# EAGLE schematic PR9010 (EAGLE 7.2.0)
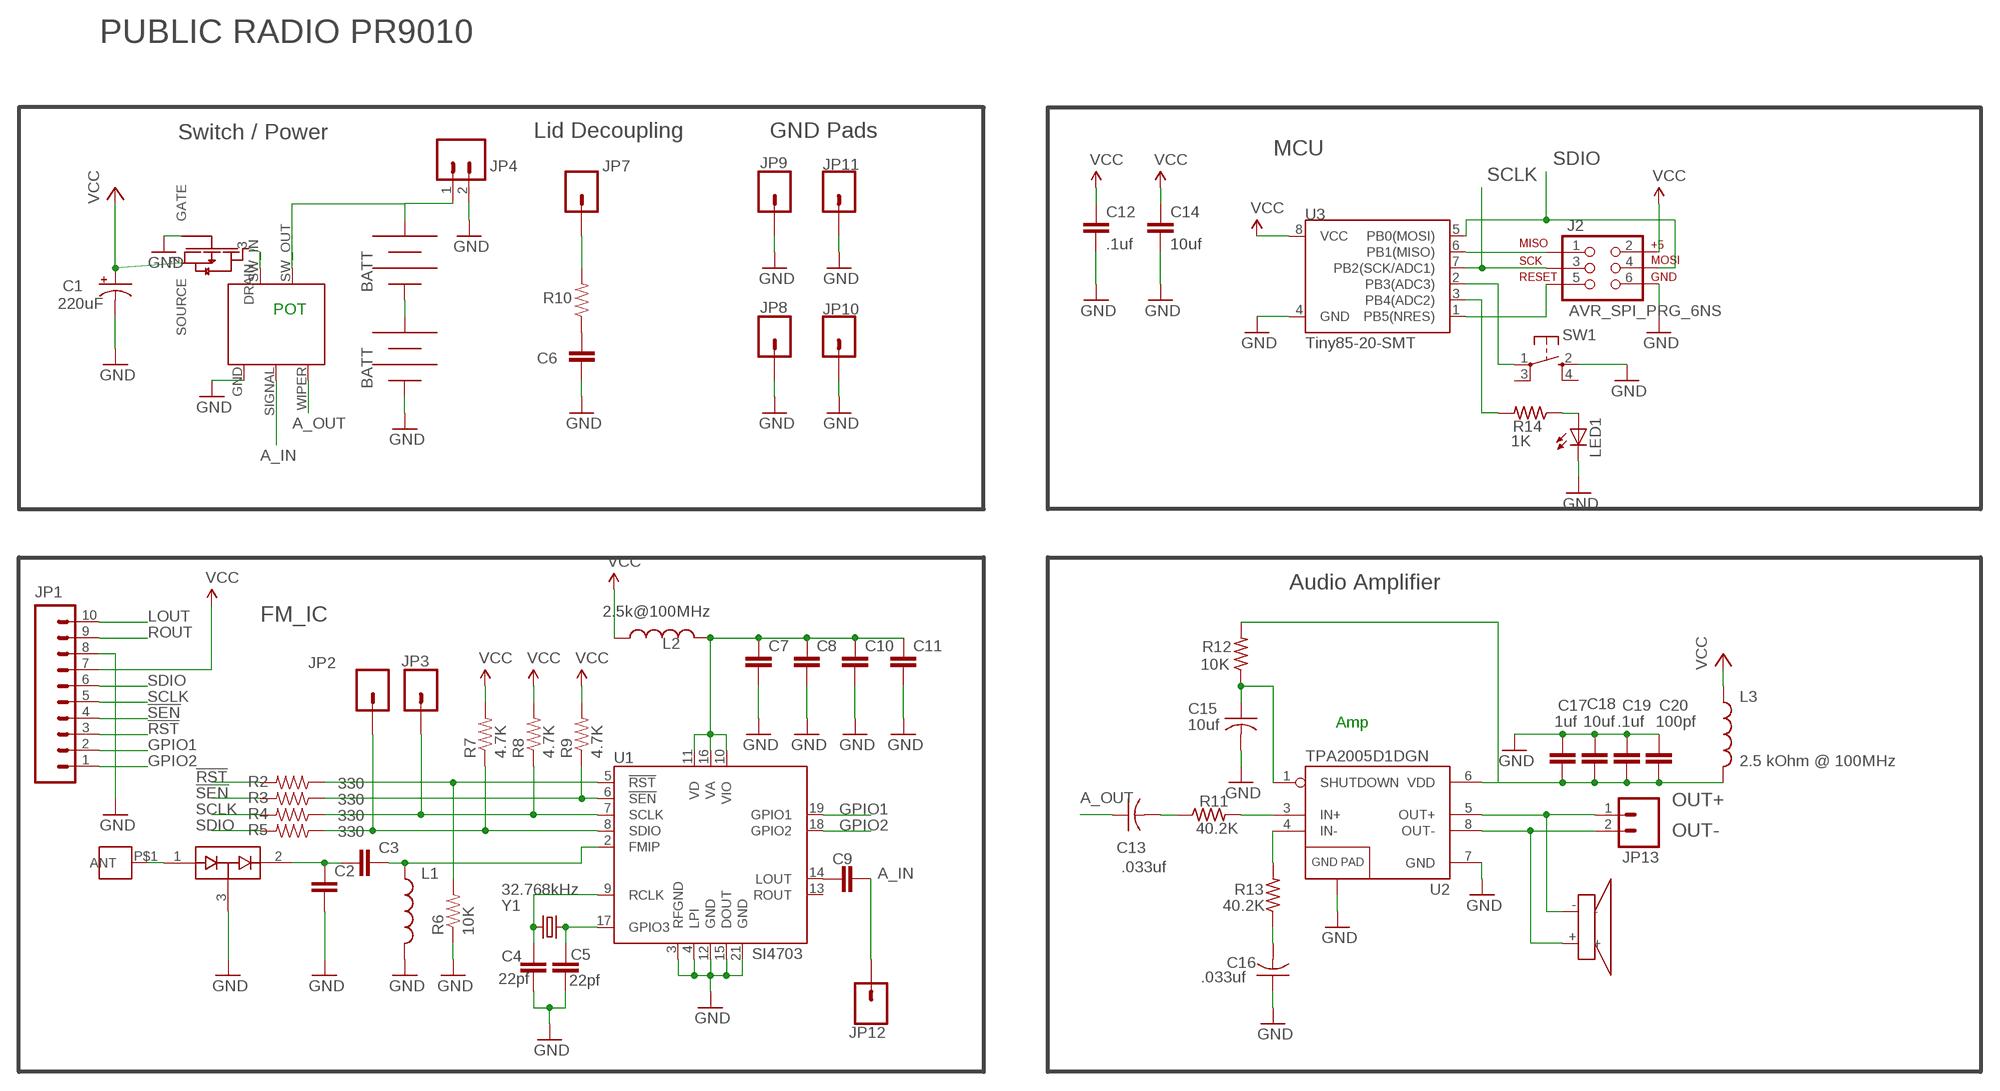
[diagram p0: schematic, sheet 1]

## Parts
C1  220uF  CAP_POLC  [PANASONIC_C]
C2  1.0uF  1.0UF-25V-+80/-20(0805)  [0805]
C3  1.0uF  1.0UF-25V-+80/-20(0805)  [0805]
C4  22pf  CAP0805  [0805]
C5  22pf  CAP0805  [0805]
C6  CAP0805  [0805]
C7  1.0uF  1.0UF-25V-+80/-20(0805)  [0805]
C8  1.0uF  1.0UF-25V-+80/-20(0805)  [0805]
C9  1.0uF  1.0UF-25V-+80/-20(0805)  [0805]
C10  1.0uF  1.0UF-25V-+80/-20(0805)  [0805]
C11  1.0uF  1.0UF-25V-+80/-20(0805)  [0805]
C12  .1uf  CAP0805  [0805]
C13  .033uf  C-USC0603  [C0603]
C14  10uf  CAP0805  [0805]
C15  10uf  C-USC0603  [C0603]
C16  .033uf  C-USC0603  [C0603]
C17  1uf  CAP0805  [0805]
C18  10uf  CAP0805  [0805]
C19  .1uf  CAP0805  [0805]
C20  100pf  CAP0805  [0805]
D1  BAV99  [SOT23]
FET1  SI2333DDS  [SI2333DDS]
J1  M3_SCREW_POST  [M3_SCREW_POST]
J2  AVR_SPI_PRG_6NS  [2X3-NS]
JP1  M10"  [1X10]
JP2  M01PTH  [1X01]
JP3  M01PTH  [1X01]
JP4  M02PTH3  [1X02_LONGPADS]
JP5  BK-92_MPD_AA_BATT_CLIP  [BK-92_MPD_AA_BATT_CLIP]
JP6  BK-92_MPD_AA_BATT_CLIP  [BK-92_MPD_AA_BATT_CLIP]
JP7  M01PTH  [1X01]
JP8  M01PTH  [1X01]
JP9  M01PTH  [1X01]
JP10  M01PTH  [1X01]
JP11  M01PTH  [1X01]
JP12  M01PTH  [1X01]
JP13  M02PTH3  [1X02_LONGPADS]
L1  INDUCTOR0805  [0805]
L2  2.5k@100MHz  INDUCTOR0603  [0603]
L3  2.5 kOhm @ 100MHz  INDUCTOR0603  [0603]
LED1  LEDSML0603  [SML0603]
R1  RV170SF_TAIWANA_POT_SW  [RV170SF_TAIWANA_POT_SW]
R2  330  RESISTOR0805-RES  [0805]
R3  330  RESISTOR0805-RES  [0805]
R4  330  RESISTOR0805-RES  [0805]
R5  330  RESISTOR0805-RES  [0805]
R6  10K  RESISTOR0805-RES  [0805]
R7  4.7K  RESISTOR0805-RES  [0805]
R8  4.7K  RESISTOR0805-RES  [0805]
R9  4.7K  RESISTOR0805-RES  [0805]
R10  RESISTOR0805-RES  [0805]
R11  40.2K  R-US_R0603  [R0603]
R12  10K  R-US_R0603  [R0603]
R13  40.2K  R-US_R0603  [R0603]
R14  1K  R-US_R0603  [R0603]
SW1  SPST_TACT-KMR2  [KMR2]
U1  SI4703  SPARKFUN_SI470X  [SPARKFUN_SI470X]
U2  TPA2005D1DGN  [POWER-SOP8]
U3  Tiny85-20-SMT  ATTINY45TINY85-20-SMT  [SO08-EIAJ]
U$3  CE32A_DAYTON_SPKR  [CE32A_DAYTON_SPKR]
Y1  32.768kHz  CRYSTAL32-SMD  [CRYSTAL-32KHZ-SMD]

## Nets
3.3V: JP1.7 R7.2 R8.2 R9.2 ; supply symbol labelled VCC
!RST: JP1.3 R2.2
!RST-L: R2.1 R6.2 U1.5(!RST)
!SEN: JP1.4 R3.2
!SEN-L: R3.1 R9.1 U1.6(!SEN)
A_IN: C9.2 JP12.1 R1.SIGNAL
A_OUT: C13.1 R1.WIPER
GND: C1.- C2.2 C4.2 C5.2 C6.2 C7.2 C8.2 C10.2 C11.2 C12.2 C14.2 C15.2 C16.1 C17.1 C18.1 C19.1 C20.1 D1.3(COM) FET1.1(GATE) J2.6 JP1.8 JP4.2 JP6.NEG JP6.NEG@2(NEG) JP8.1 JP9.1 JP10.1 JP11.1 L1.2 LED1.C R1.GND R6.1 SW1.2(S) U1.3(RFGND) U1.4(LPI) U1.12(GND) U1.15(DOUT) U1.21(GND) U2.7(GND) U2.9(GND) U3.4(GND)
GPIO1: JP1.2 U1.19(GPIO1)
GPIO2: JP1.1 U1.18(GPIO2)
LOUT: C9.1 JP1.10 U1.14(LOUT)
N$1: C4.1 U1.9(RCLK) Y1.X2
N$2: C5.1 U1.17(GPIO3) Y1.X1
N$3: C13.2 R11.1
N$4: R11.2 U2.3(IN+)
N$5: R13.2 U2.4(IN-)
N$6: C3.2 L1.1 U1.2(FMIP)
N$7: LED1.A R14.1
N$8: JP7.1 R10.2
N$9: C7.1 C8.1 C10.1 C11.1 L2.2 U1.10(VIO) U1.11(VD) U1.16(VA)
N$11: SW1.1(P) U3.2(PB3(ADC3))
N$12: R14.2 U3.3(PB4(ADC2))
N$13: JP5.NEG JP5.NEG@2(NEG) JP6.POS JP6.POS@2(POS)
N$14: D1.1(A1) J1.P$1(ANT)
N$15: JP4.1 JP5.POS JP5.POS@2(POS) R1.SW_OUT
N$17: C2.1 C3.1 D1.2(C2)
N$18: C17.2 C18.2 C19.2 C20.2 L3.2 R12.2 U2.6(VDD)
N$20: C15.1 R12.1 U2.1(SHUTDOWN)
N$23: C16.2 R13.1
N$34: FET1.3(DRAIN) R1.SW_IN
N$35: C6.1 R10.1
OUT+: JP13.1 U2.5(OUT+) U$3.-
OUT-: JP13.2 U2.8(OUT-) U$3.+
PB1: J2.1 U3.6(PB1(MISO))
PB5: J2.5 U3.1(PB5(NRES))
ROUT: JP1.9
SCLK: J2.3 JP1.5 R4.2 U3.7(PB2(SCK/ADC1))
SCLK-L: JP3.1 R4.1 R8.1 U1.7(SCLK)
SDIO: J2.4 JP1.6 R5.2 U3.5(PB0(MOSI))
SDIO-L: JP2.1 R5.1 R7.1 U1.8(SDIO)
VCC: C1.+ C12.1 C14.1 FET1.2(SOURCE) J2.2 L2.1 L3.1 U3.8(VCC)
Unconnected: SW1.3(P1) SW1.4(S1) U1.13(ROUT)

## Notes on the sheet
- PUBLIC RADIO PR9010
- Switch / Power | Lid Decoupling | GND Pads
- MCU
- POT
- Audio Amplifier
- FM_IC
- Amp

## Library data of the parts
C1 = SparkFun-Passives:CAP_POL: Capacitor Polarized These are standard SMD and PTH capacitors. Normally 10uF, 47uF, and 100uF in electrolytic and tantalum varieties. Always verify the external diameter of the through hole cap, it varies with capacity, voltage, and manufacturer. The EIA devices should be standard.
C2 C3 C7-C11 = SparkFun-Capacitors:1.0UF-25V-+80/-20(0805); PROD_ID: CAP-11625
C4-C6 C12 C14 C17-C20 = SparkFun-Passives:CAP: Capacitor Standard 0603 ceramic capacitor, and 0.1" leaded capacitor.
C13 C15 C16 = resistor:C-US: CAPACITOR, American symbol
D1 = SparkFun-DiscreteSemi:BAV99: Two small signal silicon diodes connected anode to cathode. Connections to all three nodes available. DIO-10647; PROD_ID: DIO-10647
FET1 = PubRadioLib:SI2333DDS
J1 = PR_Libraries:M3_SCREW_POST
J2 = SparkFun-Connectors:AVR_SPI_PRG_6: AVR ISP 6 Pin This is the reduced ISP connector for AVR programming. Common on Arduino. This footprint will take up less PCB space and can be used with a 10-pin to 6-pin adapter such as SKU: BOB-08508 **Special note about "TEST_POINT" package. The stop mask is on the top side, so if you want your programming test points to be on the bottom of your board, make sure to place this package on the bottom side of the board. This also ensure that the orientation to program from the bottom side will be correct.
JP1 = SparkFun-Connectors:M10: Header 10 Standard 10-pin 0.1" header. Use with straight break away headers (SKU : PRT-00116), right angle break away headers (PRT-00553), swiss pins (PRT-00743), machine pins (PRT-00117), and female headers (PRT-00115).
JP2 JP3 JP7-JP12 = SparkFun-Connectors:M01: Header 1 Standard 1-pin 0.1" header. Use with straight break away headers (SKU : PRT-00116), right angle break away headers (PRT-00553), swiss pins (PRT-00743), machine pins (PRT-00117), and female headers (PRT-00115).
JP4 JP13 = SparkFun-Connectors:M02: Standard 2-pin 0.1" header. Use with - straight break away headers ( PRT-00116) - right angle break away headers (PRT-00553) - swiss pins (PRT-00743) - machine pins (PRT-00117) - female headers (PRT-00115) Molex polarized connector foot print use with: PRT-08233 with associated crimp pins and housings. 2.54_SCREWTERM for use with PRT-10571. 3.5mm Screw Terminal footprints for PRT-08084 5mm Screw Terminal footprints for use with PRT-08432
JP5 JP6 = PR_Libraries:BK-92_MPD_AA_BATT_CLIP
L1-L3 = SparkFun-Passives:INDUCTOR: Inductors Basic Inductor/Choke - 0603 and 1206. Footprints are not proven and vary greatly between part numbers. SRN6045- 33uH, 20% 1.4A SDR0403-560KL - 56uH, 10%, 500mA RMS/740mA peak
LED1 = led:LED: LED OSRAM: - CHIPLED LG R971, LG N971, LY N971, LG Q971, LY Q971, LO R971, LY R971 LH N974, LH R974 LS Q976, LO Q976, LY Q976 LO Q996 - Hyper CHIPLED LW Q18S LB Q993, LB Q99A, LB R99A - SideLED LS A670, LO A670, LY A670, LG A670, LP A670 LB A673, LV A673, LT A673, LW A673 LH A674 LY A675 LS A676, LA A676, LO A676, LY A676, LW A676 LS A679, LY A679, LG A679 - Hyper Micro SIDELED® LS Y876, LA Y876, LO Y876, LY Y876 LT Y87S - SmartLED LW L88C, LW L88S LB L89C, LB L89S, LG L890 LS L89K, LO L89K, LY L89K LS L896, LA L896, LO L896, LY L896 - TOPLED LS T670, LO T670, LY T670, LG T670, LP T670 LSG T670, LSP T670, LSY T670, LOP T670, LYG T670 LG T671, LOG T671, LSG T671 LB T673, LV T673, LT T673, LW T673 LH T674 LS T676, LA T676, LO T676, LY T676, LB T676, LH T676, LSB T676, LW T676 LB T67C, LV T67C, LT T67C, LS T67K, LO T67K, LY T67K, LW E67C LS E67B, LA E67B, LO E67B, LY E67B, LB E67C, LV E67C, LT E67C LW T67C LS T679, LY T679, LG T679 LS T770, LO T770, LY T770, LG T770, LP T770 LB T773, LV T773, LT T773, LW T773 LH T774 LS E675, LA E675, LY E675, LS T675 LS T776, LA T776, LO T776, LY T776, LB T776 LHGB T686 LT T68C, LB T68C - Hyper Mini TOPLED® LB M676 - Mini TOPLED Santana® LG M470 LS M47K, LO M47K, LY M47K Source: http://www.osram.convergy.de LUXEON: - LUMILED® LXK2-PW12-R00, LXK2-PW12-S00, LXK2-PW14-U00, LXK2-PW14-V00 LXK2-PM12-R00, LXK2-PM12-S00, LXK2-PM14-U00 LXK2-PE12-Q00, LXK2-PE12-R00, LXK2-PE12-S00, LXK2-PE14-T00, LXK2-PE14-U00 LXK2-PB12-K00, LXK2-PB12-L00, LXK2-PB12-M00, LXK2-PB14-N00, LXK2-PB14-P00, LXK2-PB14-Q00 LXK2-PR12-L00, LXK2-PR12-M00, LXK2-PR14-Q00, LXK2-PR14-R00 LXK2-PD12-Q00, LXK2-PD12-R00, LXK2-PD12-S00 LXK2-PH12-R00, LXK2-PH12-S00 LXK2-PL12-P00, LXK2-PL12-Q00, LXK2-PL12-R00 Source: www.luxeon.com KINGBRIGHT: KA-3528ASYC Source: www.kingbright.com
R1 = PR_Libraries:RV170SF_TAIWANA_POT_SW
R2-R10 = SparkFun-Passives:RESISTOR: Resistor Basic schematic elements and footprints for 0603, 1206, and PTH resistors.
R11-R14 = resistor:R-US_: RESISTOR, American symbol
SW1 = adafruit:SPST_TACT: SMT 6mm switch, EVQQ2 series http://www.ladyada.net/library/eagle
U1 = FM-Meter-Driver-v11:SPARKFUN_SI470X: Description: This is a powerful FM receiver IC. Tested with Si4703. You really only need SEN, RST, SCLK, and SDIO to get a full FM radio working. Antenna comes from headphone jack. See breakout board on SparkFun website for more information.
U2 = SparkFun-AnalogIC:TPA2005D1: 1.4W MONO CLASS-D AUDIO POWER AMPLIFIER The TPA2005D1 is a 1.4-W high efficiency filter-free class-D audio power amplifier in a BGA, QFN, or MSOP package that requires only three external components. Datasheet: http://focus.ti.com/lit/ds/symlink/tpa2005d1.pdf 1.4 W Into 8 ? From a 5V Supply at THD = 10% (Typ) Maximum Battery Life and Minimum Heat Efficiency With an 8-? Speaker: 84% at 400 mW, 79% at 100 mW 2.8-mA Quiescent Current 0.5-mA Shutdown Current Ideal for Wireless or Cellular Handsets and PDAs Capable of Driving an 8-? Speaker (2.5 V ? VDD ? 5.5 V) and a 4-? Speaker (2.5 V ? VDD ? 4.2 V) Only Three External Components Optimized PWM Output Stage Eliminates LC Output Filter Internally Generated 250-kHz Switching Frequency Eliminates Capacitor and Resistor Improved PSRR (-71 dB at 217 Hz) and Wide Supply Voltage (2.5 V to 5.5 V) Eliminates Need for a Voltage Regulator Fully Differential Design Reduces RF Rectification and Eliminates Bypass Capacitor Improved CMRR Eliminates Two Input Coupling Capacitors
U3 = SparkFun-DigitalIC:ATTINY45: Atmel 8-pin 2/4/8kB flash uC; PROD_ID: IC-09092
U$3 = PR_Libraries:CE32A_DAYTON_SPKR
Y1 = SparkFun:CRYSTAL: Crystals Various standard crystals. Proven footprints. Spark Fun Electronics SKU : COM-00534